# Altium schematic sheet APP_1_Prog.SchDoc
size Tabloid; SheetNumber: 6; SheetTotal: 13; Sheet_Name: Prog; Size: 11x17
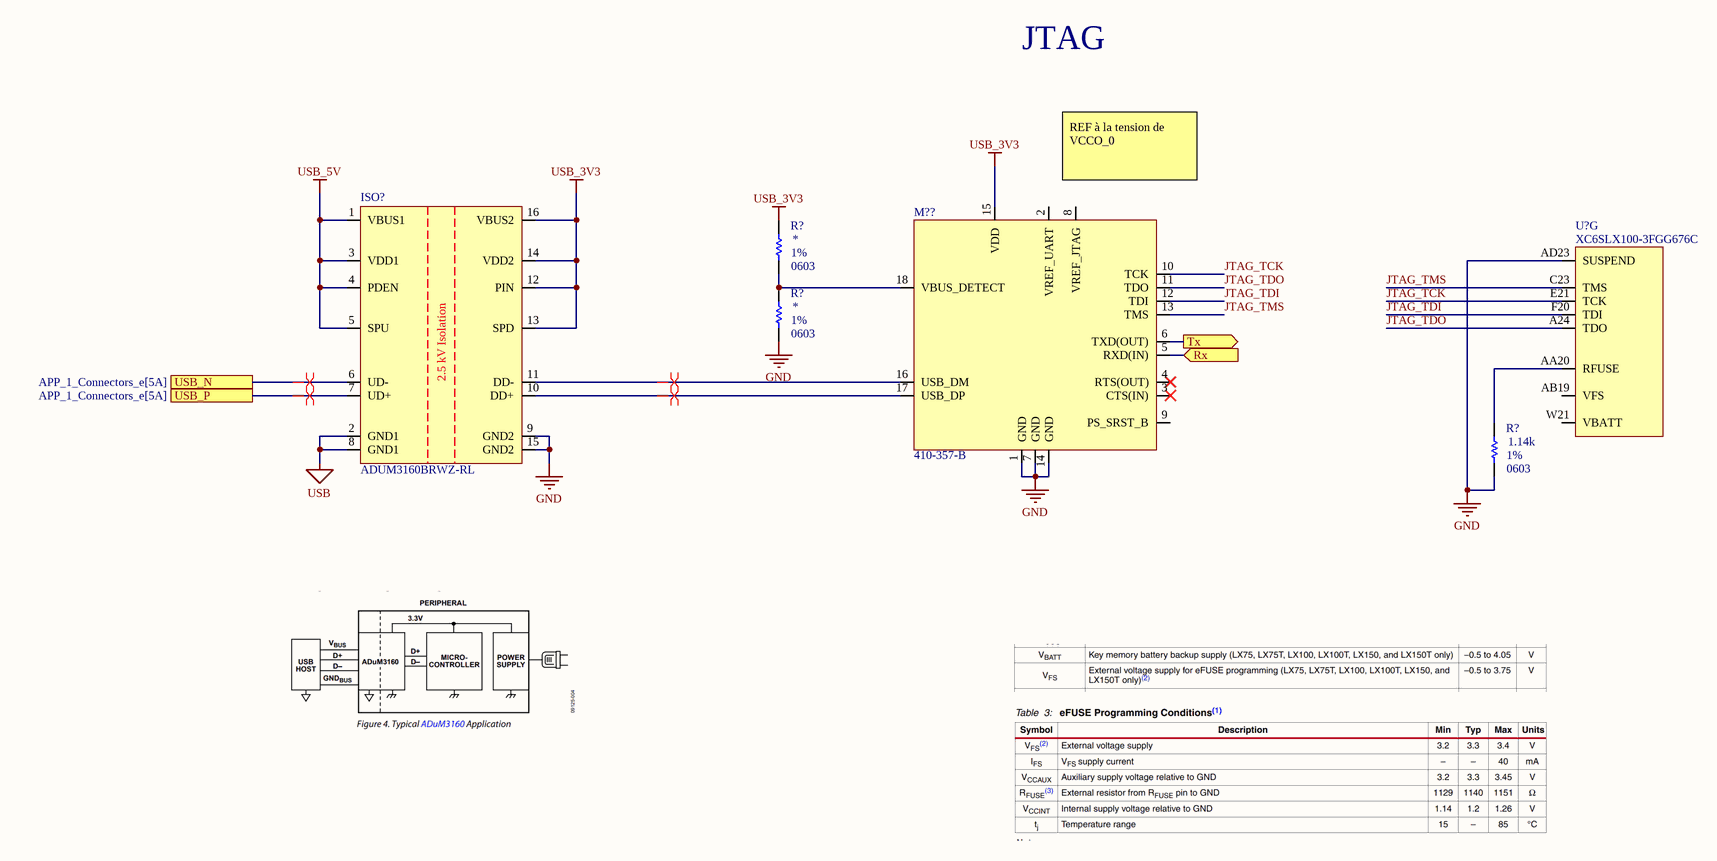
[diagram p0: APP_1_Prog.SchDoc]

## Parts
(Parts that share a designator on the sheet are numbered #1, #2 ... from top to bottom, then left to right.)
ISO?  ADUM3160BRWZ-RL  [ISO_ADUM3160BRWZ-RL]
M??  410-357-B  [MOD_JTAG_410-357-B]
R?#1  Package: 0603  Precision: 1%  [RES_0603]  (hidden comment: RES - 0603)
R?#2  Package: 0603  Precision: 1%  [RES_0603]  (hidden comment: RES - 0603)
R?#3  value 1.14k  Package: 0603  Precision: 1%  [RES_0603]  (hidden comment: RES - 0603)
U?  XC6SLX100-3FGG676C  [FPGA_XILINX_FGG676]  (part G of 10)

## Ports
Rx (in), Tx (out), USB_N (see APP_1_Connectors_e[5A]), USB_P (see APP_1_Connectors_e[5A])

## Nets
GND: ISO?.9(GND2) ISO?.15(GND2) M??.1(GND) M??.7(GND) M??.14(GND) R?#2.1 R?#3.1 U?.AD23(SUSPEND)
USB: ISO?.2(GND1) ISO?.8(GND1)
USB_3V3: ISO?.12(PIN) ISO?.13(SPD) ISO?.14(VDD2) ISO?.16(VBUS2) M??.15(VDD) R?#1.2
USB_5V: ISO?.1(VBUS1) ISO?.3(VDD1) ISO?.4(PDEN) ISO?.5(SPU)
JTAG_TCK: M??.10(TCK) U?.E21(TCK)
JTAG_TDI: M??.12(TDI) U?.F20(TDI)
JTAG_TDO: M??.11(TDO) U?.A24(TDO)
JTAG_TMS: M??.13(TMS) U?.C23(TMS)
Rx: M??.5(RXD(IN)) ; port Rx
Tx: M??.6(TXD(OUT)) ; port Tx
USB_N: ISO?.6(UD-) ; port USB_N
USB_P: ISO?.7(UD+) ; port USB_P
NetISO?_10: ISO?.10(DD+) M??.17(USB_DP)
NetISO?_11: ISO?.11(DD-) M??.16(USB_DM)
NetM??_18: M??.18(VBUS_DETECT) R?#1.1 R?#2.2
NetR?#3_2: R?#3.2 U?.AA20(RFUSE)

Not connected (* = marked no-connect by the designer): M?? 2(VREF_UART) 3(CTS(IN))* 4(RTS(OUT))* 8(VREF_JTAG) 9(PS_SRST_B); U? AB19(VFS) W21(VBATT)

## Layout directives
differential pair: NetISO?_10, NetISO?_11, USB_N, USB_P

## Notes on the sheet
- JTAG
- (near M??) REF à la tension de VCCO_0
- Sheet Name
- Project Title
- Global Project
- Size
- Group
- Revision
- Date
- Sheet
- of
- Filename
- Designers
- (in symbol ISO_ADUM3160BRWZ-RL) 2.5 kV Isolation

## Library data of the parts
ISO? = ISO_ADUM3160BRWZ-RL: ISO - DGTL ISO 2.5KV 2CH USB - 16SOIC; Manufacturer #1: Analog Devices; Value: 2500Vrms voltage isolation; Voltage Rating: 3~5.5V; GRAMS Lib Spec: 2.8; Magnetic Material: UNKNOWN; Polarized: Yes; Tolerance: *; Current Rating: *; Power Max: *; HelpURL: https://www.analog.com/media/en/technical-documentation/data-sheets/ADuM3160.pdf; CreatedBy/Date: Tommy Rossignol 2018-11-16; VerifiedBy: Caroline Paulin - 13 février 2019; Temperature: -40°C ~ 105°C; Package: 16-SOIC; Manufacturer #2: *; Assembly Type: SMD; Part Number #2: *; Part Number #1: ADUM3160BRWZ-RL; Supplier 1: Digi-Key; Supplier Part Number 1: ADUM3160BRWZ-RLCT-ND; Cryo: UNKNOWN
M?? = MOD_JTAG_410-357-B: MOD - JTAG-SMT3-NC Programming Module For Xilinx FPGA - 18-SMT; Manufacturer #1: Digilent; Voltage Rating: VDD: 2.97V~3.63V, VJTAG/VUART: 1.65V~5.5V; GRAMS Lib Spec: 2.8; Note: Prior to reflow, the JTAG-SMT3-NC module must be dried at 125°C for 17 hours; Magnetic Material: Unknown; Polarized: Yes; Value: *; Tolerance: *; Current Rating: *; Power Max: *; HelpURL: https://reference.digilentinc.com/_media/reference/programmers/jtag-smt3/jtag-smt3-nc_rm.pdf; CreatedBy/Date: Tommy Rossignol 2018-11-23; VerifiedBy: Nicolas V. (2019-01-28); Temperature: -40°C ~ 85°C; Package: 18-pad SMT; Manufacturer #2: *; Assembly Type: SMD; Part Number #2: *; Part Number #1: 410-357-B; Supplier 1: Digi-Key; Supplier Part Number 1: 1286-1196-ND; Cryo: UNKNOWN
U? = FPGA_XC6SLX100-3FGG676C: FPGA - XILINX SPARTAN 6 480 I/O - BGA-676; Voltage: 1.14 V ~ 1.26 V; Current: *; Power: *; Mfg: Xilinx; Mfg Part Number: XC6SLX100-3FGG676C; HelpURL: https://www.xilinx.com/support/documentation/data_sheets/ds162.pdf; CreatedBy: Jonathan Bouchard; Temperature: 0°C ~ 85°C (TJ); Value: *; Precision: *; Package: BGA-676; Supplier 1: Digikey; Supplier Part Number 1: 122-1760-ND
R?#1-R?#3 = RES - 0603: Current: *; CreatedBy: Jonathan Bouchard
  R?#1 R?#2: Value: *